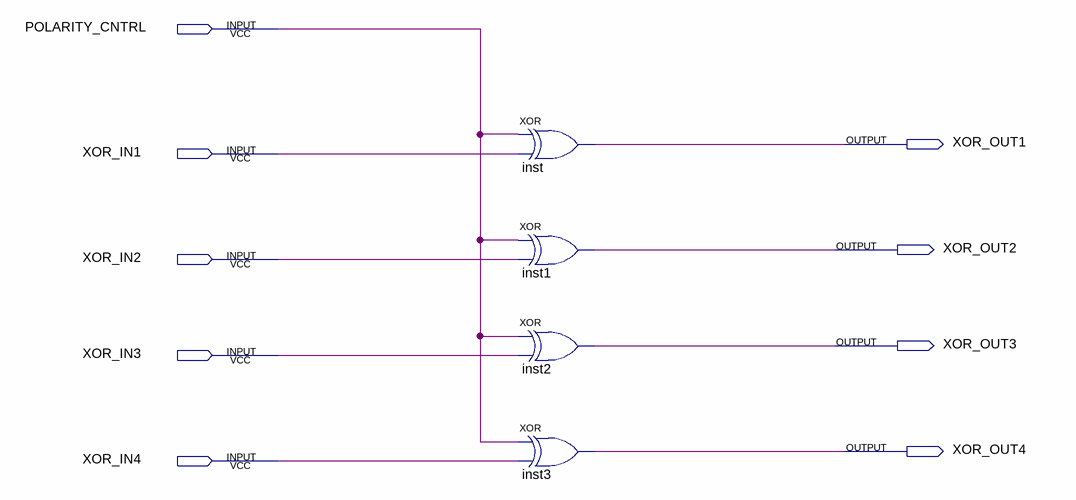
[diagram p0: schematic sheet]
// Quartus schematic Polarity_control.bdf as structural Verilog: 4 symbols, 9 pins
module Polarity_control (
  input  POLARITY_CNTRL,
  input  XOR_IN1,
  input  XOR_IN2,
  input  XOR_IN3,
  input  XOR_IN4,
  output XOR_OUT1,
  output XOR_OUT2,
  output XOR_OUT3,
  output XOR_OUT4
);

  xor inst (XOR_OUT1, POLARITY_CNTRL, XOR_IN1);
  xor inst1 (XOR_OUT2, POLARITY_CNTRL, XOR_IN2);
  xor inst2 (XOR_OUT3, POLARITY_CNTRL, XOR_IN3);
  xor inst3 (XOR_OUT4, POLARITY_CNTRL, XOR_IN4);
endmodule
